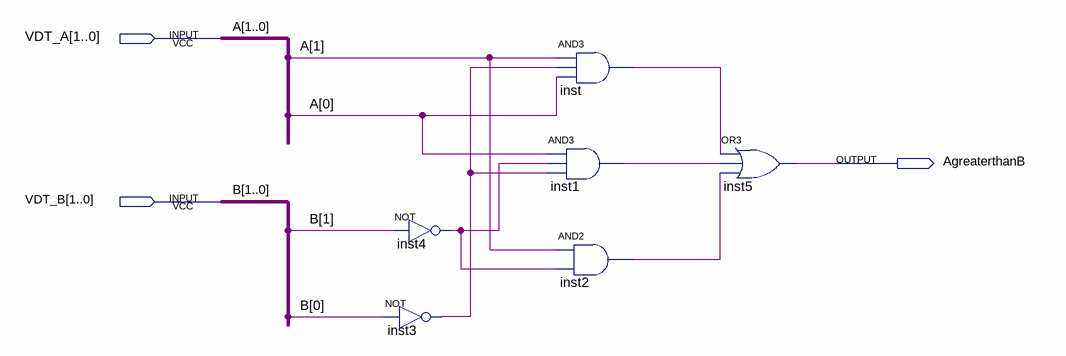
[diagram p0: schematic sheet]
// Quartus schematic assignment1.bdf as structural Verilog: 6 symbols, 3 pins
module assignment1 (
  input  [1:0] VDT_A,
  input  [1:0] VDT_B,
  output AgreaterthanB
);

  wire inst1_out, inst2_out, inst3_out, inst4_out, inst_out;

  not inst4 (inst4_out, VDT_B[1]);
  not inst3 (inst3_out, VDT_B[0]);
  and inst1 (inst1_out, VDT_A[0], inst4_out, inst3_out);
  and inst (inst_out, VDT_A[1], inst3_out, VDT_A[0]);
  and inst2 (inst2_out, VDT_A[1], inst4_out);
  or inst5 (AgreaterthanB, inst_out, inst1_out, inst2_out);

  // Other names for the same wires on the sheet: A[1:0] = VDT_A; B[1:0] = VDT_B
endmodule
